# EAGLE design stepper_driver (EAGLE 9.1.0)
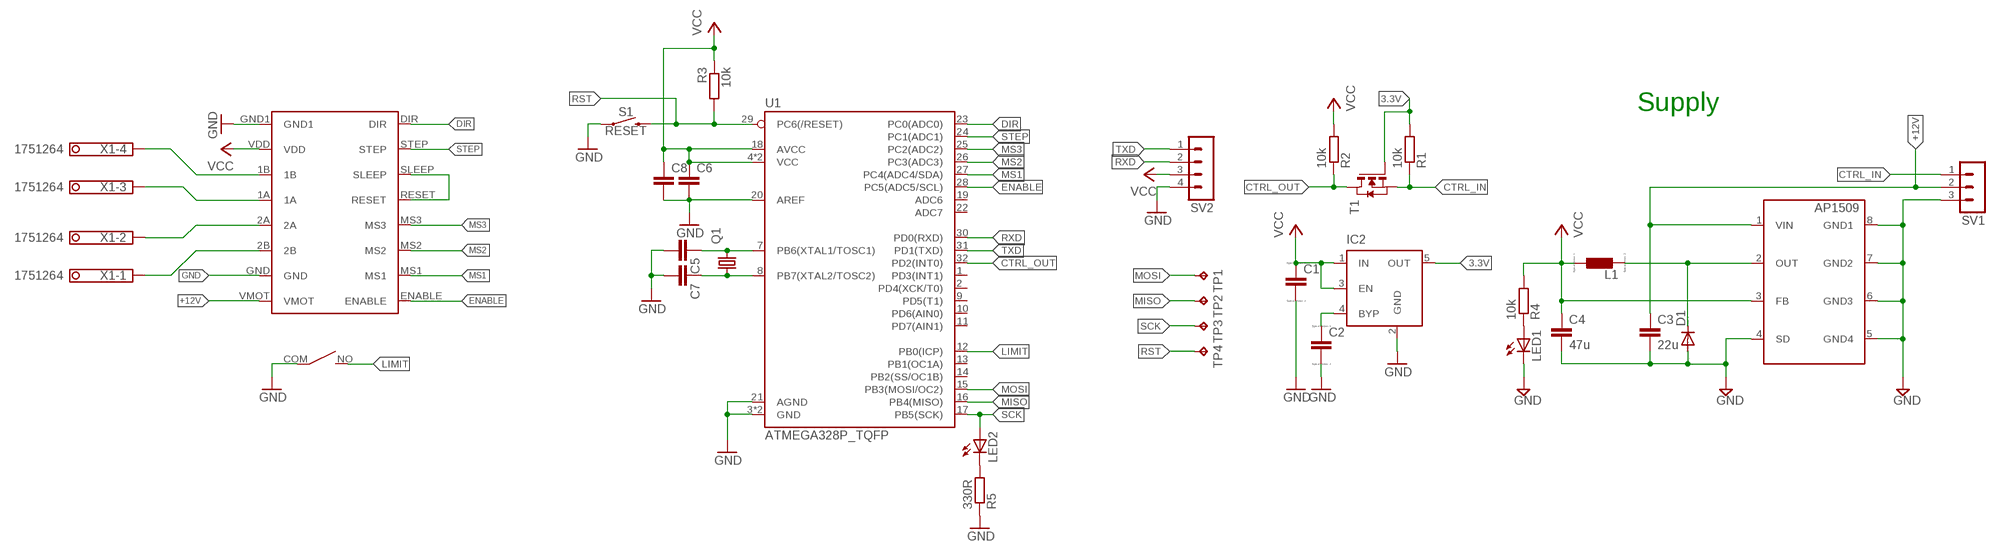
[diagram p0: schematic, sheet 1]

## Parts
C1  C  [C0805]
C2  C  [C0805]
C3  22u  C-EUC1210  [C1210]
C4  47u  C-EUC1210  [C1210]
C5  C-EUC0603K  [C0603K]
C6  C-EUC0805  [C0805]
C7  C-EUC0603K  [C0603K]
C8  C-EUC0805  [C0805]
D1  DIODE-SOD323-W  [SOD323-W]
IC2  MIC5219XX  [SOT23-5]
L1  LL5650M  [L5650M]
LED1  LEDSML0805  [SML0805]
LED2  LEDSML0805  [SML0805]
Q1  KX-7  [3.2X2.5_KX-7]
R1  10k  R-EU_R0805  [R0805]
R2  10k  R-EU_R0805  [R0805]
R3  10k  R-EU_R0805  [R0805]
R4  10k  R-EU_R0805  [R0805]
R5  330R  R-EU_R0805  [R0805]
S1  RESET  MOMENTARY-SWITCH-SPST-SMD-6.0X3.5MM  [TACTILE_SWITCH_SMD_6.0X3.5MM]
SV1  MA03-1  [MA03-1]
SV2  MA04-1  [MA04-1]
T1  NMOSSOT23  [SOT-23]
TP1  TPTP20SQ  [TP20SQ]
TP2  TPTP20SQ  [TP20SQ]
TP3  TPTP20SQ  [TP20SQ]
TP4  TPTP20SQ  [TP20SQ]
U1  ATMEGA328P_TQFP  [TQFP32-08]
U$1  AP1509  [SOP08]
U$2  A4988MODULE  [A4988]
U$3  D2S  [D2S]
X1  1751264  [1751264]

## Nets
3.3V: IC2.5(OUT) R1.2 T1.3(G)
+12V: C3.1 SV1.2 U$1.1(VIN) U$2.VMOT
CTRL_IN: R1.1 SV1.1 T1.2(S)
CTRL_OUT: R2.1 T1.1(D) U1.32(PD2(INT0))
DIR: U1.23(PC0(ADC0)) U$2.DIR
ENABLE: U1.28(PC5(ADC5/SCL)) U$2.ENABLE
GND: C1.2 C2.2 C3.2 C4.2 C5.2 C6.2 C7.2 C8.2 D1.A IC2.2(GND) LED1.C R5.1 S1.1 SV1.3 SV2.4 U1.3(GND) U1.5(GND) U1.20(AREF) U1.21(AGND) U$1.4(SD) U$1.5(GND4) U$1.6(GND3) U$1.7(GND2) U$1.8(GND1) U$2.GND U$2.GND1 U$3.COM
LIMIT: U1.12(PB0(ICP)) U$3.NO
MISO: TP2.TP U1.16(PB4(MISO))
MOSI: TP1.TP U1.15(PB3(MOSI/OC2))
MS1: U1.27(PC4(ADC4/SDA)) U$2.MS1
MS2: U1.26(PC3(ADC3)) U$2.MS2
MS3: U1.25(PC2(ADC2)) U$2.MS3
N$1: U$2.1B X1.4
N$2: U$2.1A X1.3
N$3: U$2.RESET U$2.SLEEP
N$4: U$2.2A X1.2
N$5: U$2.2B X1.1
N$6: C2.1 IC2.4(BYP)
N$7: LED1.A R4.1
N$8: D1.C L1.2 U$1.2(OUT)
N$10: C7.1 Q1.1 U1.8(PB7(XTAL2/TOSC2))
N$11: C5.1 Q1.3 U1.7(PB6(XTAL1/TOSC1))
N$12: LED2.C R5.2
RST: R3.2 S1.2 TP4.TP U1.29(PC6(/RESET))
RXD: SV2.2 U1.30(PD0(RXD))
SCK: LED2.A TP3.TP U1.17(PB5(SCK))
STEP: U1.24(PC1(ADC1)) U$2.STEP
TXD: SV2.1 U1.31(PD1(TXD))
VCC: C1.1 C4.1 C6.1 C8.1 IC2.1(IN) IC2.3(EN) L1.1 R2.2 R3.1 R4.2 SV2.3 U1.4(VCC) U1.6(VCC) U1.18(AVCC) U$1.3(FB) U$2.VDD
Unconnected: U1.1(PD3(INT1)) U1.2(PD4(XCK/T0)) U1.9(PD5(T1)) U1.10(PD6(AIN0)) U1.11(PD7(AIN1)) U1.13(PB1(OC1A)) U1.14(PB2(SS/OC1B)) U1.19(ADC6) U1.22(ADC7)

## Notes on the sheet
- Supply

## Library data of the parts
C1 C2 = eagle-ltspice:C: CAPACITOR, European symbol; SPICEMODEL: NONE; SPICEPREFIX: C
C3-C8 = rcl:C-EU: CAPACITOR, European symbol; SPICEPREFIX: C
D1 = diode:DIODE-: DIODE; TME: BAS3010A03WE6327HT
IC2 = v-reg-micrel:MIC5219XX: VOLTAGE REGULATOR; OC_FARNELL: unknown; OC_NEWARK: unknown; TME: TC1017-3.3VCT
L1 = eagle-ltspice:L: INDUCTOR, European symbol; SPICEMODEL: NONE; SPICEPREFIX: L; TME: DJNR4018-470-S
LED1 LED2 = led:LED: LED OSRAM: - CHIPLED LG R971, LG N971, LY N971, LG Q971, LY Q971, LO R971, LY R971 LH N974, LH R974 LS Q976, LO Q976, LY Q976 LO Q996 - Hyper CHIPLED LW Q18S LB Q993, LB Q99A, LB R99A - SideLED LS A670, LO A670, LY A670, LG A670, LP A670 LB A673, LV A673, LT A673, LW A673 LH A674 LY A675 LS A676, LA A676, LO A676, LY A676, LW A676 LS A679, LY A679, LG A679 - Hyper Micro SIDELED® LS Y876, LA Y876, LO Y876, LY Y876 LT Y87S - SmartLED LW L88C, LW L88S LB L89C, LB L89S, LG L890 LS L89K, LO L89K, LY L89K LS L896, LA L896, LO L896, LY L896 - TOPLED LS T670, LO T670, LY T670, LG T670, LP T670 LSG T670, LSP T670, LSY T670, LOP T670, LYG T670 LG T671, LOG T671, LSG T671 LB T673, LV T673, LT T673, LW T673 LH T674 LS T676, LA T676, LO T676, LY T676, LB T676, LH T676, LSB T676, LW T676 LB T67C, LV T67C, LT T67C, LS T67K, LO T67K, LY T67K, LW E67C LS E67B, LA E67B, LO E67B, LY E67B, LB E67C, LV E67C, LT E67C LW T67C LS T679, LY T679, LG T679 LS T770, LO T770, LY T770, LG T770, LP T770 LB T773, LV T773, LT T773, LW T773 LH T774 LS E675, LA E675, LY E675, LS T675 LS T776, LA T776, LO T776, LY T776, LB T776 LHGB T686 LT T68C, LB T68C - Hyper Mini TOPLED® LB M676 - Mini TOPLED Santana® LG M470 LS M47K, LO M47K, LY M47K Source: http://www.osram.convergy.de LUXEON: - LUMILED® LXK2-PW12-R00, LXK2-PW12-S00, LXK2-PW14-U00, LXK2-PW14-V00 LXK2-PM12-R00, LXK2-PM12-S00, LXK2-PM14-U00 LXK2-PE12-Q00, LXK2-PE12-R00, LXK2-PE12-S00, LXK2-PE14-T00, LXK2-PE14-U00 LXK2-PB12-K00, LXK2-PB12-L00, LXK2-PB12-M00, LXK2-PB14-N00, LXK2-PB14-P00, LXK2-PB14-Q00 LXK2-PR12-L00, LXK2-PR12-M00, LXK2-PR14-Q00, LXK2-PR14-R00 LXK2-PD12-Q00, LXK2-PD12-R00, LXK2-PD12-S00 LXK2-PH12-R00, LXK2-PH12-S00 LXK2-PL12-P00, LXK2-PL12-Q00, LXK2-PL12-R00 Source: www.luxeon.com KINGBRIGHT: KA-3528ASYC Source: www.kingbright.com
Q1 = crystal-geyer_V1_0:KX: Quartz Crystals (MHz) SMD: KX - Serie Model Size l/w/h [mm] Frequency Range Frequency Stability Temp. Range [°C] Load Capacitance AECQ 200 availabel Datasheet KX-4 KX-5 KX-6 KX-7 KX-9A KX-9B KX-12A KX-12B KX-13 KX-20 KX-K KX-KS 1.6/1.2/0.3 2.0/1.6/0.45 2.5/2.0/0.55 3.2/2.5/0.8 5.0/3.2/1.0 5.0/3.2/1.1 6.0/3.5/1.1 6.0/3.5/1.0 7.0/5.0 /1.3 11.6/5.5/1.6 12.3/4.5/4.2 12.3/4.5/3.2 24.0 ~ 80.0 MHz 16.0 ~ 80.0 MHz 12.0 ~ 80.0 MHz 8.0 ~ 60.0 MHz 7,68 ~ 300,0 MHz 8,0 ~ 50,0 MHz 8,0 ~ 150,0 MHz 8,0 ~ 50,0 MHz 6,0 ~ 160,0 MHz 3,579 ~ 25,0 MHz 3,579 ~ 70,0 MHz 3,579 ~ 70,0 MHz ±10 … ±50ppm ±10 … ±50ppm ±10 … ±50ppm ±10 … ±50ppm ±10 … ±50ppm ±10 … ±50ppm ±10 … ±50ppm ±10 … ±50ppm ±10 … ±50ppm ±50ppm ±10 … ±50ppm ±10 … ±50ppm (*) -40°C …+85°C (*) -40°C …+125°C (*) -40°C …+125°C (*) -40°C …+125°C (*) -40°C …+105°C (*) -40°C …+105°C (*) -40°C …+125°C (*) -40°C …+105°C (*) -40°C …+105°C (*) -40°C …+105°C (*) -40°C …+85°C (*) -40°C …+85°C 8, 8…16 8, 8…16 10, 8…16 12, 7…20 16, 10…20 16, 10…20 16, 10…20 16, 12…20 16, 12…20 16, 12…20 16, 12…30 16, 12…30 - yes yes yes - - - - - - - - KX-4.pdf <http://www.geyer-electronic.de/uploads/tx_userartikelfrequenz/GEYER-KX-4.pdf> KX-5.pdf <http://www.geyer-electronic.de/uploads/tx_userartikelfrequenz/GEYER-KX-5.pdf> KX-6.pdf <http://www.geyer-electronic.de/uploads/tx_userartikelfrequenz/GEYER-KX-6.pdf> KX-7.pdf <http://www.geyer-electronic.de/uploads/tx_userartikelfrequenz/GEYER-KX-7.pdf> KX-9A.pdf <http://www.geyer-electronic.de/uploads/tx_userartikelfrequenz/GEYER-KX-9A.pdf> KX-9B.pdf <http://www.geyer-electronic.de/uploads/tx_userartikelfrequenz/GEYER-KX-9B.pdf> KX-12A.pdf <http://www.geyer-electronic.de/uploads/tx_userartikelfrequenz/GEYER-KX-12A.pdf> KX-12B.pdf <http://www.geyer-electronic.de/uploads/tx_userartikelfrequenz/GEYER-KX-12B.pdf> KX-13.pdf <http://www.geyer-electronic.de/uploads/tx_userartikelfrequenz/GEYER-KX-13.pdf> KX-20.pdf <http://www.geyer-electronic.de/uploads/tx_userartikelfrequenz/GEYER-KX-20.pdf> KX-K.pdf <http://www.geyer-electronic.de/uploads/tx_userartikelfrequenz/GEYER-KX-K.pdf> KX-KS.pdf <http://www.geyer-electronic.de/uploads/tx_userartikelfrequenz/GEYER-KX-KS.pdf> <http://www.geyer-electronic.de/fileadmin/template/img/logo-geyer-electronic.png> Details see: http://www.geyer-electronic.de/Frequenz-Produkte.9.0.html Created 2016-06-07, Hans Locher 2016 (C) Geyer Quartz Technology KX4,KX5,KX6,KX7,KX9A,KX9B,KX12A,KX12B,KX13,KX20,KXK,KXKS;1612;2016;2520;3225;5032;6035;7050;11655;12345;1,6x1,2;2,0x1,6;2,5x2,0;3,2x2,5;5,0x3,2;6,0x3,5;7,0x5,0;11,6x5,5;12,3x4,5;12,3x4,5;1.6x1.2;2.0x1.6;2.5x2.0;3.2x2.5;5.0x3.2;6.0x3.5;7.0x5.0;11.6x5.5;12.3x4.5;12.3x4.5;; TME: 3225-16M-SR
R1-R5 = rcl:R-EU_: RESISTOR, European symbol; SPICEPREFIX: R
S1 = SparkFun-Switches:MOMENTARY-SWITCH-SPST: Momentary Switch (Pushbutton) - SPST Normally-open (NO) SPST momentary switches (buttons, pushbuttons). Variants PTH-12MM - 12mm square, through-hole Momentary Pushbutton Switch - 12mm Square <https://www.sparkfun.com/products/9190> (COM-09190) PTH-6.0MM, PTH-6.0MM-KIT - 6.0mm square, through-hole Mini Pushbutton Switch <https://www.sparkfun.com/products/97> (COM-00097) KIT package intended for soldering kit's - only one side of pads' copper is exposed. PTH-RIGHT-ANGLE-KIT - Right-angle, through-hole Right Angle Tactile Button <https://www.sparkfun.com/products/10791> - Used on SparkFun BigTime Watch Kit <https://www.sparkfun.com/products/11734> SMD-12MM - 12mm square, surface-mount Tactile Button - SMD (12mm) <https://www.sparkfun.com/products/12993> (COM-12993) Used on SparkFun PicoBoard <https://www.sparkfun.com/products/11888> SMD-4.5MM - 4.5mm Square Trackball Switch Used on SparkFun Blackberry Trackballer Breakout <https://www.sparkfun.com/products/13169> SMD-4.6MMX2.8MM - 4.60mm x 2.80mm, surface mount Used on SparkFun SAMD21 Mini Breakout <https://www.sparkfun.com/products/13664> SMD-5.2MM, SMD-5.2-REDUNDANT - 5.2mm square, surface-mount Mini Pushbutton Switch - SMD <https://www.sparkfun.com/products/8720> (COM-08720) Used on Arduino Pro Mini <https://www.sparkfun.com/products/11114> REDUNDANT package connects both switch circuits together SMD-6.0X3.5MM - 6.0 x 3.5mm, surface mount Momentary Reset Switch SMD <https://www.sparkfun.com/products/8229> (COM-08229) SMD-6.2MM-TALL - 6.2mm square, surface mount Tactile Button - SMD (6mm) <https://www.sparkfun.com/products/12992> Used on SparkFun Digital Sandbox <https://www.sparkfun.com/products/12651> SMD-RIGHT-ANGLE - Right-angle, surface mount Used on SparkFun Block for Intel® Edison - Arduino <https://www.sparkfun.com/products/13036>; PROD_ID: SWCH-00815; SF_SKU: COM-08229
SV1 = con-lstb:MA03-1: PIN HEADER; OC_FARNELL: unknown; OC_NEWARK: unknown
SV2 = con-lstb:MA04-1: PIN HEADER; OC_FARNELL: unknown; OC_NEWARK: unknown
T1 = zetex:NMOSSOT23: MOS FET; OC_FARNELL: unknown; OC_NEWARK: unknown
TP1-TP4 = testpad:TP: Test pad
U1 = SparkFun-IC-Microcontroller:ATMEGA328P_TQFP: Popular 328P in QFP Storefront component: ATmega328 - TQFP <https://www.sparkfun.com/products/13448> (COM-13448) Datasheet <http://www.sparkfun.com/datasheets/Components/SMD/ATMega328.pdf> SparkFun Products SparkFun RedBoard - Programmed with Arduino <https://www.sparkfun.com/products/12757> (DEV-12757) Arduino Pro Mini 328 - 5V/16MHz <https://www.sparkfun.com/products/11113> (DEV-11113) Arduino Pro Mini 328 - 3.3V/8MHz <https://www.sparkfun.com/products/11114> (DEV-11114) SparkFun OpenLog <https://www.sparkfun.com/products/13712> (DEV-13712) SparkFun MicroView - OLED Arduino Module <https://www.sparkfun.com/products/12923> (DEV-12923) SparkFun Digital Sandbox <https://www.sparkfun.com/products/12651> (DEV-12651) SparkFun PicoBoard <https://www.sparkfun.com/products/11888> (WIG-11888) Arduino Fio <https://www.sparkfun.com/products/10116> (DEV-10116) LilyPad Arduino 328 Main Board <https://www.sparkfun.com/products/13342> (DEV-13342) SparkFun RedStick <https://www.sparkfun.com/products/13741> (DEV-13741) LilyPad MP3 <https://www.sparkfun.com/products/11013> (DEV-11013) LilyPad Arduino SimpleSnap <https://www.sparkfun.com/products/10941> (DEV-10941) SparkFun Stepoko <https://www.sparkfun.com/products/13899> (ROB-13899) SparkFun Geiger Counter <https://www.sparkfun.com/products/11345> (SEN-11345) SparkFun EL Sequencer <https://www.sparkfun.com/products/12781> (COM-12781) Arduino Pro 328 - 5V/16MHz <https://www.sparkfun.com/products/10915> (DEV-10915) CryptoCape <https://www.sparkfun.com/products/12773> (DEV-12773) SparkFun IR Thermometer Evaluation Board - MLX90614 <https://www.sparkfun.com/products/10740> (SEN-10740) SparkFun RedBot Mainboard <https://www.sparkfun.com/products/12097> (ROB-12097) Arduino Pro 328 - 3.3V/8MHz <https://www.sparkfun.com/products/10914> (DEV-10914) SparkFun Block for Intel® Edison - Arduino <https://www.sparkfun.com/products/13036> (DEV-13036) SparkFun Simon Says - Surface Mount Soldering Kit <https://www.sparkfun.com/products/10935> (KIT-10935) SparkFun 7-Segment Serial Display - Red <https://www.sparkfun.com/products/11441> (COM-11441) SparkFun 7-Segment Serial Display - White <https://www.sparkfun.com/products/11629> (COM-11629) SparkFun 7-Segment Serial Display - Yellow <https://www.sparkfun.com/products/11443> (COM-11443) SparkFun 7-Segment Serial Display - Kelly Green <https://www.sparkfun.com/products/11440> (COM-11440) SparkFun 7-Segment Serial Display - Blue <https://www.sparkfun.com/products/11442> (COM-11442) SparkFun OpenSegment Serial Display - 20mm (Blue) <https://www.sparkfun.com/products/11647> (COM-11647) SparkFun OpenSegment Serial Display - 20mm (Green) <https://www.sparkfun.com/products/11646> (COM-11646) SparkFun OpenSegment Serial Display - 20mm (White) <https://www.sparkfun.com/products/11648> (COM-11648) SparkFun OpenSegment Serial Display - 20mm (Red) <https://www.sparkfun.com/products/11644> (COM-11644) SparkFun OpenSegment Serial Display - 20mm (Yellow) <https://www.sparkfun.com/products/11645> (COM-11645) SparkFun OpenSegment Shield <https://www.sparkfun.com/products/13190> (DEV-13190); PROD_ID: IC-09069
U$1 = AP1509:AP1509
U$2 = a4988module:A4988MODULE
U$3 = d2sLimitSwitch:D2S
X1 = con-phoenix-350:1751264: MKDS 1/ 4-3,5 Printklemme Nennstrom: 10 A Bemessungsspannung: 160 V Raster: 3,5 mm Polzahl: 4 Montageart: Löten Anschlussart: Schraubanschluss Anschlussrichtung vom Leiter zur Platine: 0° Source: http://eshop.phoenixcontact.com .. 1751264.pdf; MPN: 1751264; OC_FARNELL: unknown; OC_NEWARK: 10R0934

## Board
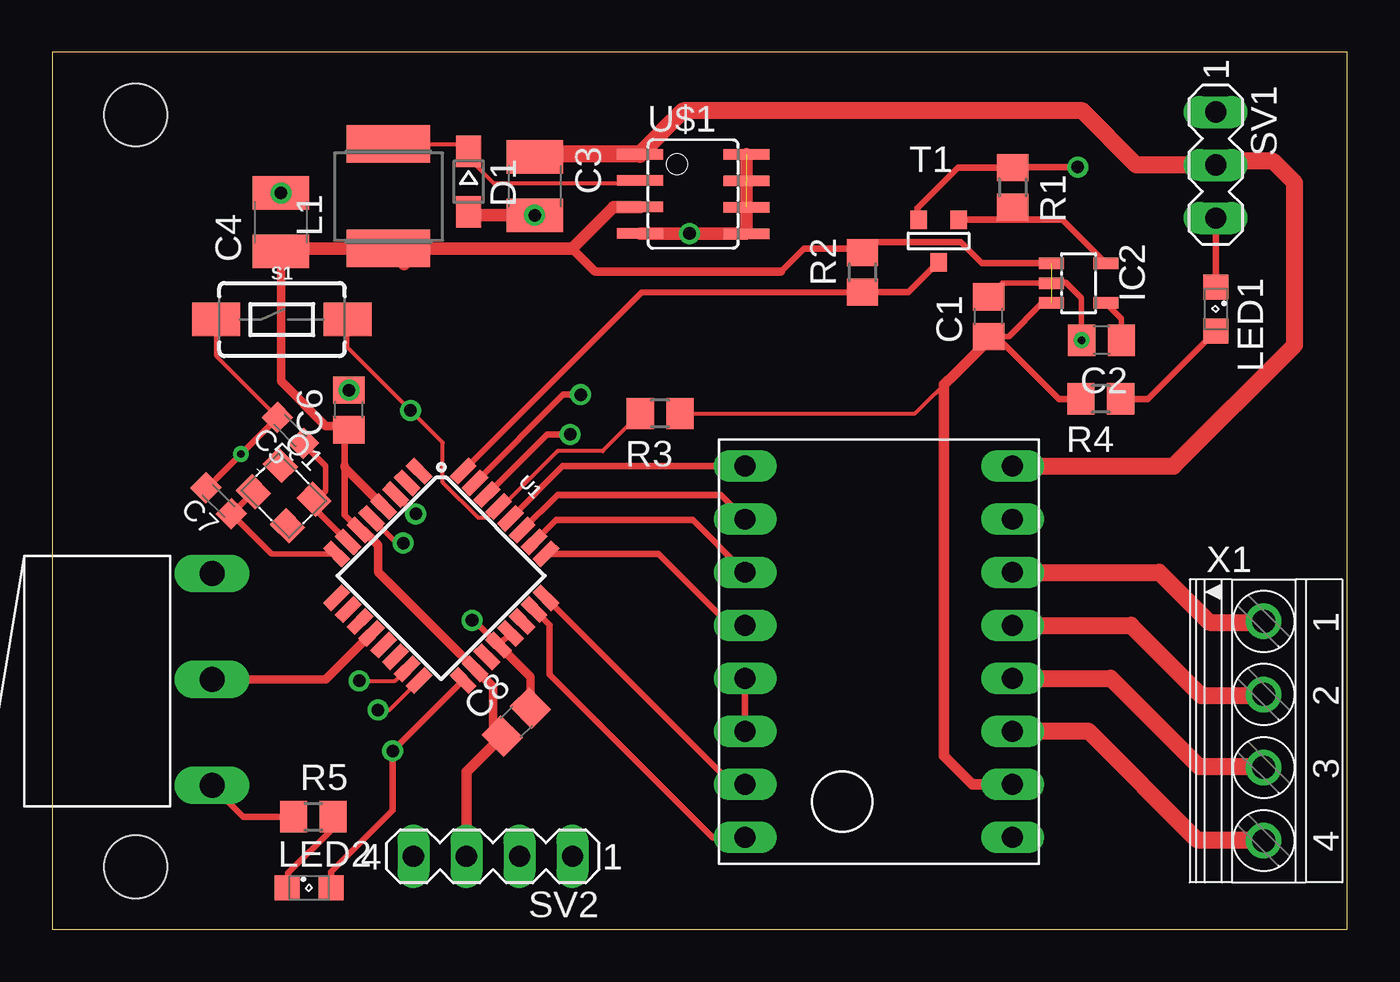
[diagram p1: board, top side]
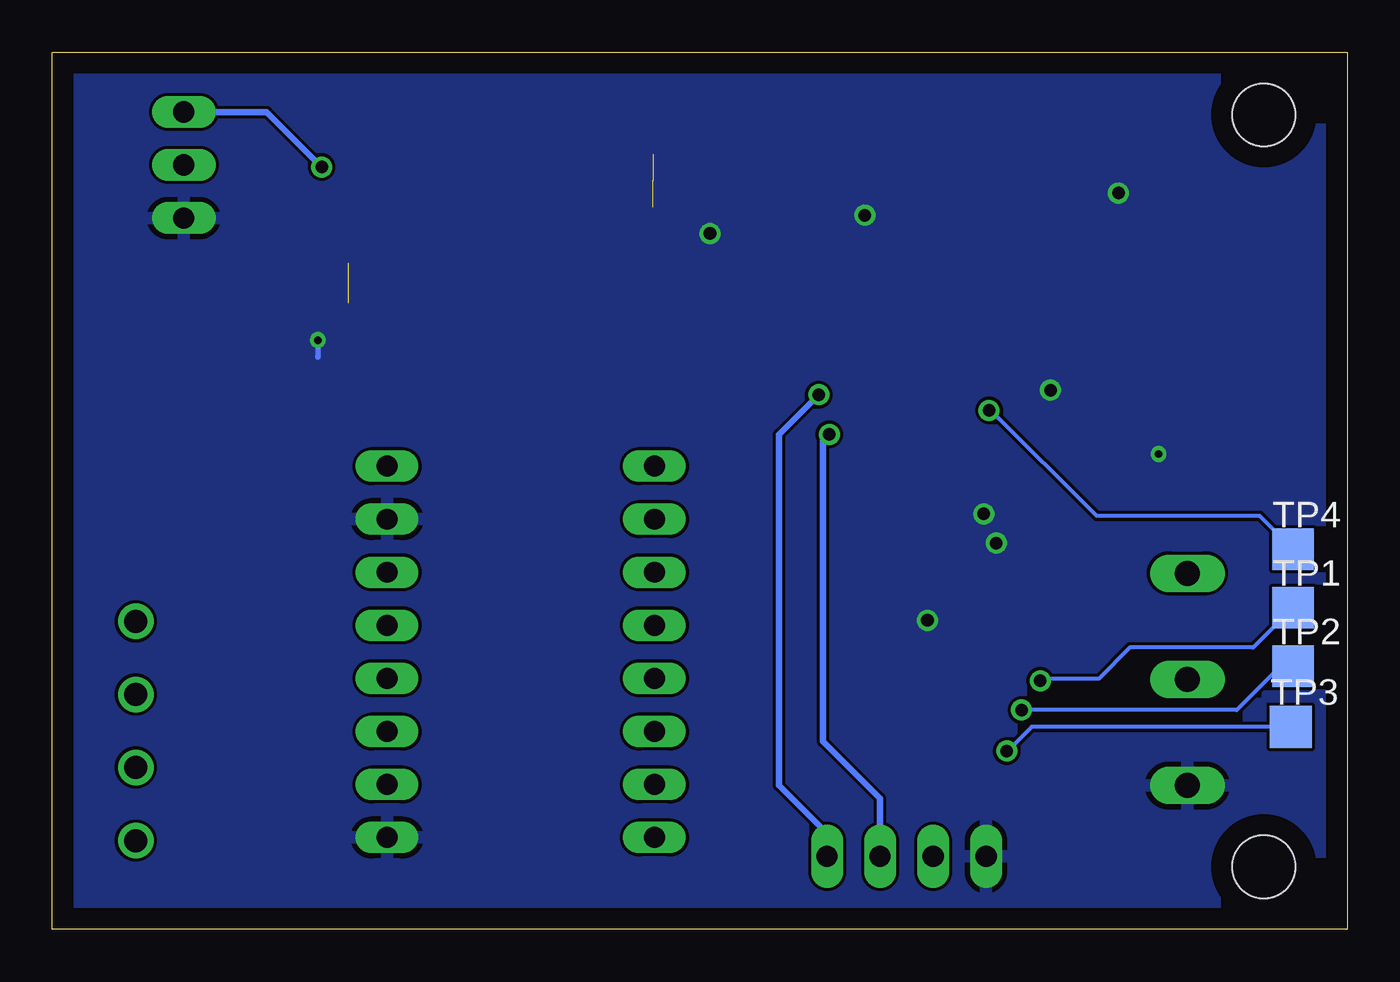
[diagram p2: board, bottom side, seen from below]

Size 62 x 42 mm. Coordinates in mm from the lower left corner, seen from the top.
Outline: 62,42 0,42 0,0 62,0 62,42
Copper layers (1*16): Top 0.035mm / dielectric 1.5mm / Bottom 0.035mm
Design rules "default": minimum track width 6mil, minimum drill 0.35mm, track to track 6mil, track to pad 6mil, pad to pad 6mil, via to via 6mil, smd to smd 6mil, copper to edge 40mil, drill to drill 6mil, minimum pad ring 10mil, minimum via ring 8mil, stop-mask expansion 4mil, vias tented up to drill 0mil, thermal gap 10mil
Holes 3 mm at 4,3 4,39

### Footprints (pad centres in the part's own frame; a part is rotated, then mirrored left to right if it is on the bottom)
C0805 = smd 1.3 x 1.5: 1 -0.95,0; 2 0.95,0
C1210 = smd 1.6 x 2.7: 1 -1.4,0; 2 1.4,0
C0603K = smd 1.05 x 1.08: 1 -0.875,0; 2 0.875,0
SOD323-W = smd 1.5 x 1.2: A 1.45,0; C -1.45,0
SOT23-5 = smd 0.55 x 1.2: 1 -0.95,-1.3; 2 0,-1.3; 3 0.95,-1.3; 4 0.95,1.3; 5 -0.95,1.3
L5650M = smd 1.8 x 4: 1 -2.5,0; 2 2.5,0
SML0805 = smd 1.2 x 1.2: A 1.05,0; C -1.05,0
3.2X2.5_KX-7 = smd 1.3 x 1.1: 1 -1.15,-0.9; 2 1.15,-0.9; 3 1.15,0.9; 4 -1.15,0.9
R0805 = smd 1.3 x 1.5: 1 -0.95,0; 2 0.95,0
TACTILE_SWITCH_SMD_6.0X3.5MM = smd 2.3 x 1.6: 1 -3.15,0; 2 3.15,0
MA03-1 = drill 1.016 long: 1 -2.54,0; 2 0,0; 3 2.54,0
MA04-1 = drill 1.016 long: 1 -3.81,0; 2 -1.27,0; 3 1.27,0; 4 3.81,0
SOT-23 = smd 0.787 x 0.889: 1 0.025,-1.016; 2 -0.94,1.016; 3 0.991,1.016
TP20SQ = smd 2 x 2: TP 0,0
TQFP32-08 = smd 1.27 x 0.559: 1 -4.293,2.8; 2 -4.293,2; 3 -4.293,1.2; 4 -4.293,0.4; 5 -4.293,-0.4; 6 -4.293,-1.2; 7 -4.293,-2; 8 -4.293,-2.8; 17 4.293,-2.8; 18 4.293,-2; 19 4.293,-1.2; 20 4.293,-0.4; 21 4.293,0.4; 22 4.293,1.2; 23 4.293,2; 24 4.293,2.8 | smd 0.559 x 1.27: 9 -2.8,-4.293; 10 -2,-4.293; 11 -1.2,-4.293; 12 -0.4,-4.293; 13 0.4,-4.293; 14 1.2,-4.293; 15 2,-4.293; 16 2.8,-4.293; 25 2.8,4.293; 26 2,4.293; 27 1.2,4.293; 28 0.4,4.293; 29 -0.4,4.293; 30 -1.2,4.293; 31 -2,4.293; 32 -2.8,4.293
SOP08 = smd 0.5 x 2.2: 1 -1.905,-2.9; 2 -0.645,-2.9; 3 0.625,-2.9; 4 1.895,-2.9; 5 1.905,2.2; 6 0.635,2.2; 7 -0.635,2.2; 8 -1.905,2.2
A4988 = drill 1 long: 1A 14.04,8.89; 1B 14.04,6.35; 2A 14.04,11.43; 2B 14.04,13.97; DIR 1.24,1.27; ENABLE 1.24,19.05; GND 14.04,16.51; GND1 14.04,1.27; MS1 1.24,16.51; MS2 1.24,13.97; MS3 1.24,11.43; RESET 1.24,8.89; SLEEP 1.24,6.35; STEP 1.24,3.81; VDD 14.04,3.81; VMOT 14.04,19.05
D2S = drill 1.2 long: COM 0,0; NO 5.08,0; P$3 10.16,0
1751264 = drill 1.1 pad 1.7: 1 -5.25,-0.1; 2 -1.75,-0.1; 3 1.75,-0.1; 4 5.25,-0.1

### Placement (x,y rotation side)
C1  44.83,29.34 90 top
C2  50.23,28.21 180 top
C3  23.1,35.59 270 top
C4  10.95,33.86 90 top
C5  11.4,23.89 135 top
C6  14.21,24.87 90 top
C7  7.97,20.52 135 top
C8  22.22,9.92 45 top
D1  19.93,35.8 270 top
IC2  49.14,30.94 270 top
L1  16.1,35.1 90 top
LED1  55.7,29.7 270 top
LED2  12.3,2 0 top
Q1  11.09,20.77 315 top
R1  45.98,35.52 270 top
R2  38.79,31.46 90 top
R3  29.1,24.7 180 top
R4  50.2,25.4 180 top
R5  12.5,5.4 0 top
S1  11,29.2 0 top
SV1  55.7,36.6 270 top
SV2  21.1,3.5 180 top
T1  42.41,32.96 0 top
TP1  2.6,15.4 0 bottom
TP2  2.6,12.6 0 bottom
TP3  2.7,9.7 0 bottom
TP4  2.6,18.2 0 bottom
U1  18.62,16.93 315 top
U$1  31.03,35.21 270 top
U$2  31.93,3.13 0 top
U$3  7.65,6.89 90 top
X1  58.1,9.5 270 top

### Tracks (layer width: path | path; a pad name or v marks a point on that pad's centre or on a via)
3.3V
  Top 0.305: 46,33.98 T1.3 43.33,34.05 | 46,33.98 48.35,33.98 49.21,33.12 IC2.5 | R1.2 45.98,34 46,33.98
+12V
  Top 0.813: U$2.VMOT 53.68,22.18 59.48,27.98 59.48,35.75 58.45,36.78 55.88,36.78 SV1.2 51.91,36.6 49.32,39.19 30.2,39.19 U$1.1 23.22,37.12 C3.1
CTRL_IN  (via drill 0.6)
  Top 0.305: T1.2 41.43,34.02 41.43,34.53 43.37,36.47 R1.1 46.01,36.5 v49.1,36.5
  Bottom 0.305: SV1.1 51.74,39.14 v49.1,36.5 49,36.4
CTRL_OUT
  Top 0.305: U1.32 28.22,30.49 R2.1 41,30.51 T1.1
DIR
  Top 0.305: U1.23 23.8,14.58 23.8,12.2 31.6,4.4 U$2.DIR
ENABLE
  Top 0.305: U1.28 24.44,22.18 U$2.ENABLE
GND  (via drill 0.35, 0.6)  (2 unrouted)
  Top 0.203: C5.2 7.85,27.44 S1.1
  Top 0.254: C5.2 v9.04,22.76 7.41,21.14 C7.2 | U1.20 20.18,14.8 v20.1,14.8 | U1.3 17.4,19.85 17.4,19.8 v17.4,19.9 | U1.5 16.28,18.7 16.3,18.7 16.5,18.5 v16.8,18.5 | C1.2 45.48,30.94 IC2.2 48.44,30.94 48.5,31 49.28,30.22 C2.2
  Top 0.305: U1.20 U1.21 | LED1.C SV1.3 | R5.1 9.14,5.4 U$3.COM
  Top 0.406: C8.2 22.89,12.1 U1.20
  Top 0.61: D1.A 20.09,34.19 C3.2 | v30.51,33.31 U$1.4 v30.51,33.31 | v30.51,33.31 U$1.5 U$1.8
  Top 0.813: 46.84,19.64 U$2.GND
  Bottom 0.254: C2.2 49.28,27.42 49.3,27.4
  other vias: 23.1,34.19 10.95,35.26 10.95,35.26 49.28,28.21 14.21,25.82
  pour Bottom: 0.5,41.5 61.5,41.5 61.5,0.4 0.5,0.4
LIMIT
  Top 0.406: U$3.NO 13.09,11.97 U1.12
MISO  (via drill 0.6)
  Top 0.203: v15.6,10.5 16.15,10.5 U1.16
  Bottom 0.203: TP2.TP 3.2,12.6 5.3,10.5 15.5,10.5 15.6,10.6 v15.6,10.5
MOSI  (via drill 0.6)
  Top 0.203: v14.7,11.9 16.42,11.9 U1.15
  Bottom 0.203: v14.7,11.9 14.6,12 11.9,12 10.4,13.5 4.5,13.5 TP1.TP
MS1
  Top 0.305: U1.27 24.19,20.8 32.01,20.8 U$2.MS1
MS2
  Top 0.305: U1.26 24.12,19.6 30.67,19.6 U$2.MS2
MS3
  Top 0.305: U1.25 29.01,17.98 32.44,14.56
  Top 0.406: 32.44,14.56 U$2.MS3
N$1
  Top 0.813: U$2.1B 45.99,9.5 49.6,9.5 54.8,4.3 57.95,4.3 X1.4
N$2
  Top 0.813: X1.3 57.95,7.8 54.9,7.8 50.68,12.02 U$2.1A
N$3
  Top 0.305: U$2.RESET U$2.SLEEP
N$4
  Top 0.813: U$2.2A 51.64,14.56 55,11.2 57.95,11.2 X1.2
N$5
  Top 0.813: X1.1 57.95,14.7 55.4,14.7 53,17.1 U$2.2B
N$6
  Top 0.254: C2.1 51.18,29.25 IC2.4
N$7
  Top 0.305: R4.1 52.45,25.4 LED1.A
N$8
  Top 0.2: U$1.2 27.25,35.85 arc90 27.11,35.71 21.15,35.71 19.93,36.93 D1.C 19.58,37.6 L1.2
N$10
  Top 0.254: Q1.1 C7.1 10.51,17.98 U1.8
N$11
  Top 0.254: Q1.3 12.54,20.4 | 12.54,20.4 12.54,20.18 U1.7 | C5.1 13.1,22.19 13.1,21 12.54,20.44 12.54,20.4
N$12
  Top 0.305: LED2.C 11.3,2.05 11.3,2.7 13.45,4.85 R5.2
RST  (via drill 0.6)
  Top 0.203: R3.2 26.35,22.9 24.2,22.9 21.55,20.25 U1.29 20.82,19.7 20.4,19.7 18.7,21.4 18.7,23.3 v17.15,24.85 14.15,27.85 S1.2
  Bottom 0.203: TP4.TP 4.2,19.8 12,19.8 17.05,24.85 v17.15,24.85
RXD  (via drill 0.6)
  Top 0.305: v24.8,23.7 23.69,23.7 U1.30
  Bottom 0.305: SV2.2 22.37,6.27 25.1,9 25.1,23.4 v24.8,23.7
SCK  (via drill 0.6)
  Top 0.305: LED2.A 13.35,2.75 16.3,5.7 v16.3,8.54 U1.17
  Bottom 0.203: TP3.TP 15.1,9.7 16.3,8.5 v16.3,8.54
STEP
  Top 0.305: U1.24 32.57,6.94 U$2.STEP
TXD  (via drill 0.6)
  Top 0.305: v25.3,25.6 24.46,25.6 U1.31
  Bottom 0.305: SV2.1 24.91,4.61 27.2,6.9 27.2,23.7 v25.3,25.6
VCC  (1 unrouted)
  Top 0.203: R3.1 41.31,24.7 43.2,26.59
  Top 0.254: IC2.3 47.39,29.99 45.79,28.39 45.2,28.39 45,28.39 C1.1
  Top 0.305: 34.9,31.5 36,32.6 38.6,32.6 38.75,32.45 | 38.75,32.45 R2.2 | IC2.1 44.51,31.89 43.5,32.9 39.2,32.9 38.75,32.45 | R4.2 48.19,25.4 45.2,28.39 | C6.1 14,23.71 14,22.2 14,19.85 U1.6
  Top 0.406: 14.19,23.9 C6.1 | C8.1 21.1,9.7 21.1,11.6 20.24,12.46 U1.18 15.6,17.12 15.6,18.4 14.88,19.12 U1.6 | U1.4 14,22.12 14,22.2 | 10.95,27.65 10.95,27.9 | 10.95,27.9 C4.1 | C6.1 14.03,24.1 13.1,24.1 10.95,26.25 10.95,27.9 | C6.1 14.21,24.39 | 34.9,31.5 25.99,31.5 24.89,32.6
  Top 0.508: U$2.VDD 44.06,6.94 42.7,8.3 42.7,26.09 43.2,26.59 45,28.39 | SV2.3 19.83,7.54 C8.1
  Top 0.61: U$1.3 26.88,34.59 24.89,32.6 L1.1 | L1.1 11.09,32.6 C4.1 arc-90 11.42,31.99 | 16.85,31.85 L1.1
  Top 0.813: 17.31,32.6 L1.1

### Text on the board
tDocu: 2B | 2A | 1A | 1B